# Altium schematic sheet [04] - CPU - DDR3, DDR3 MEM.SchDoc
size A2; DocumentNumber: 4; SheetNumber: 4; SheetTotal: 20
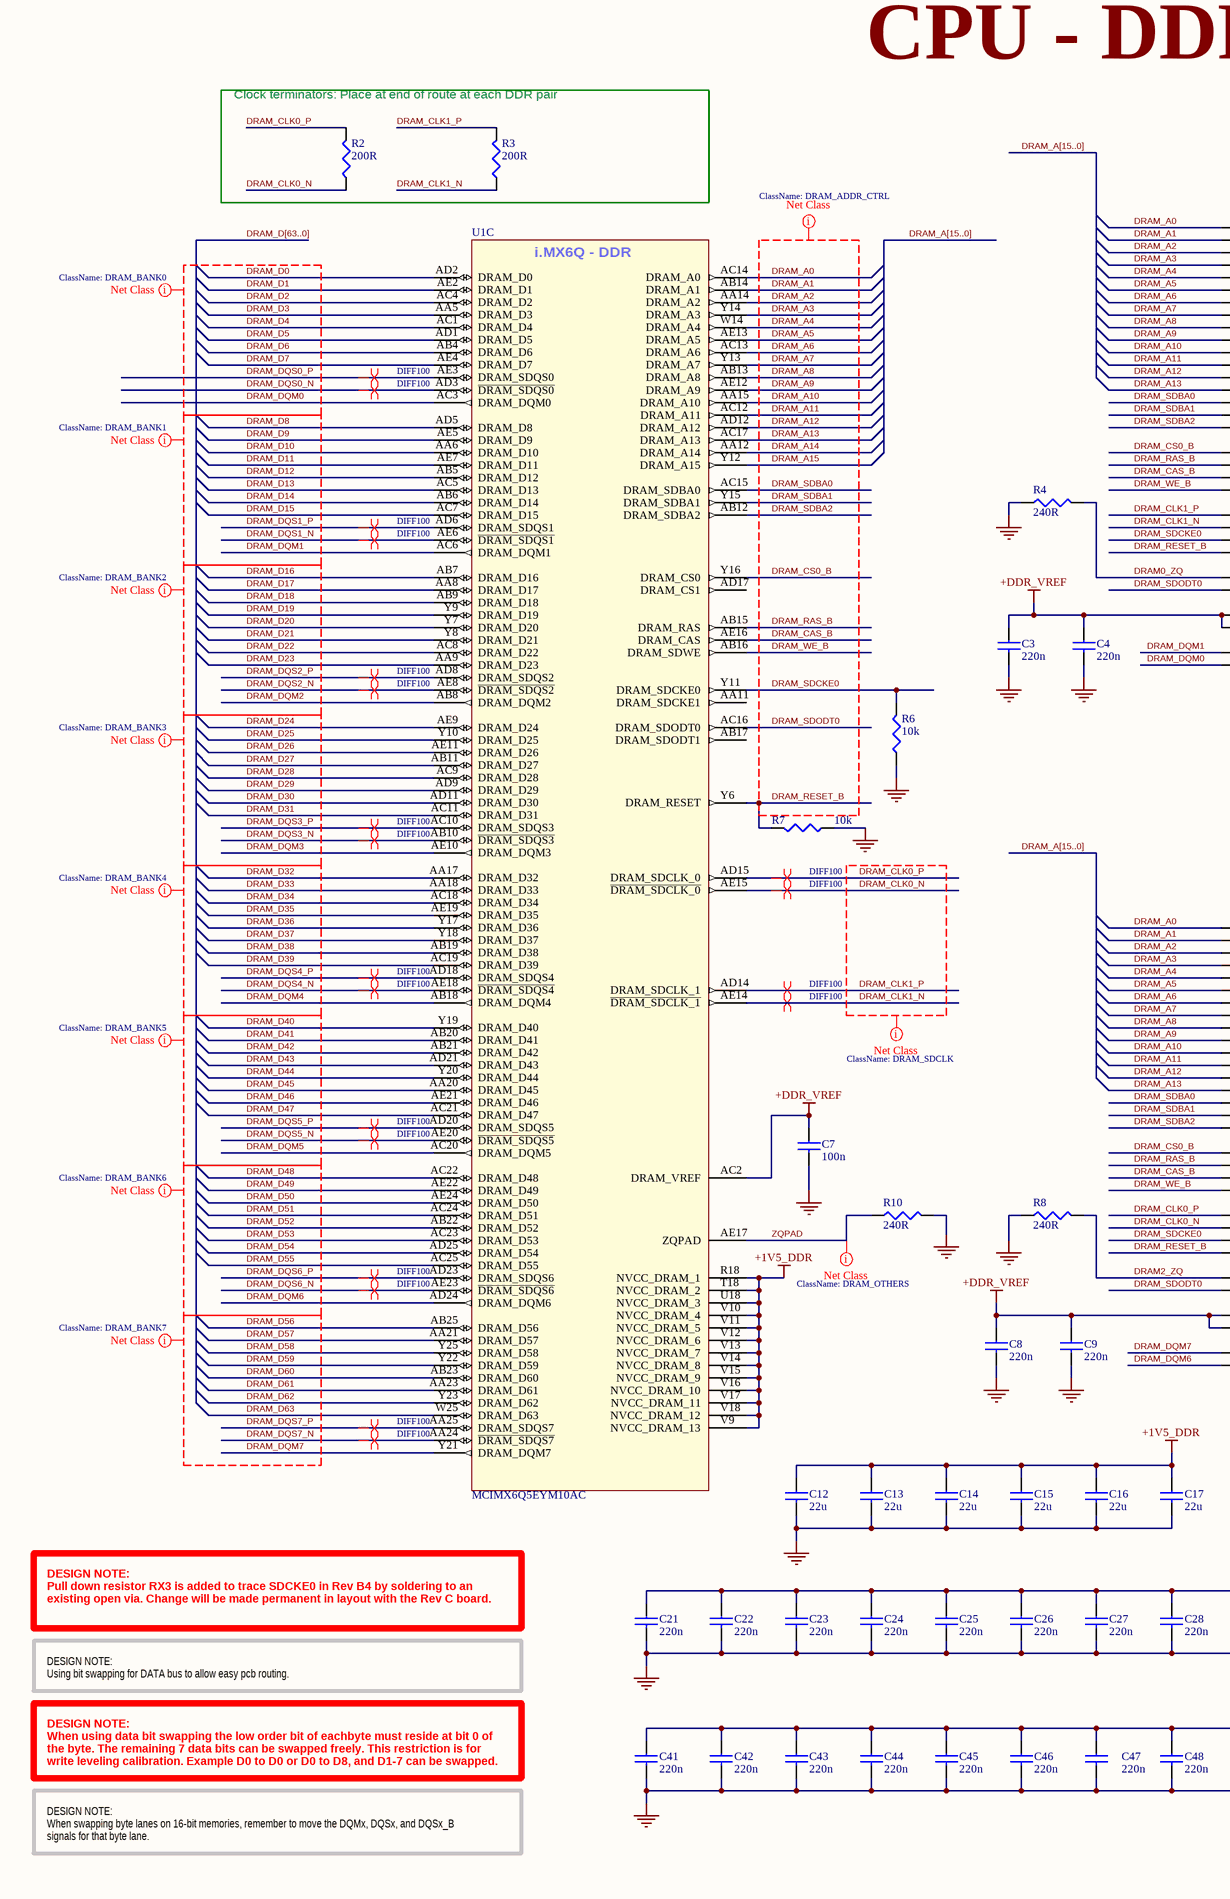
[diagram p0: [04] - CPU - DDR3, DDR3 MEM.SchDoc, left]
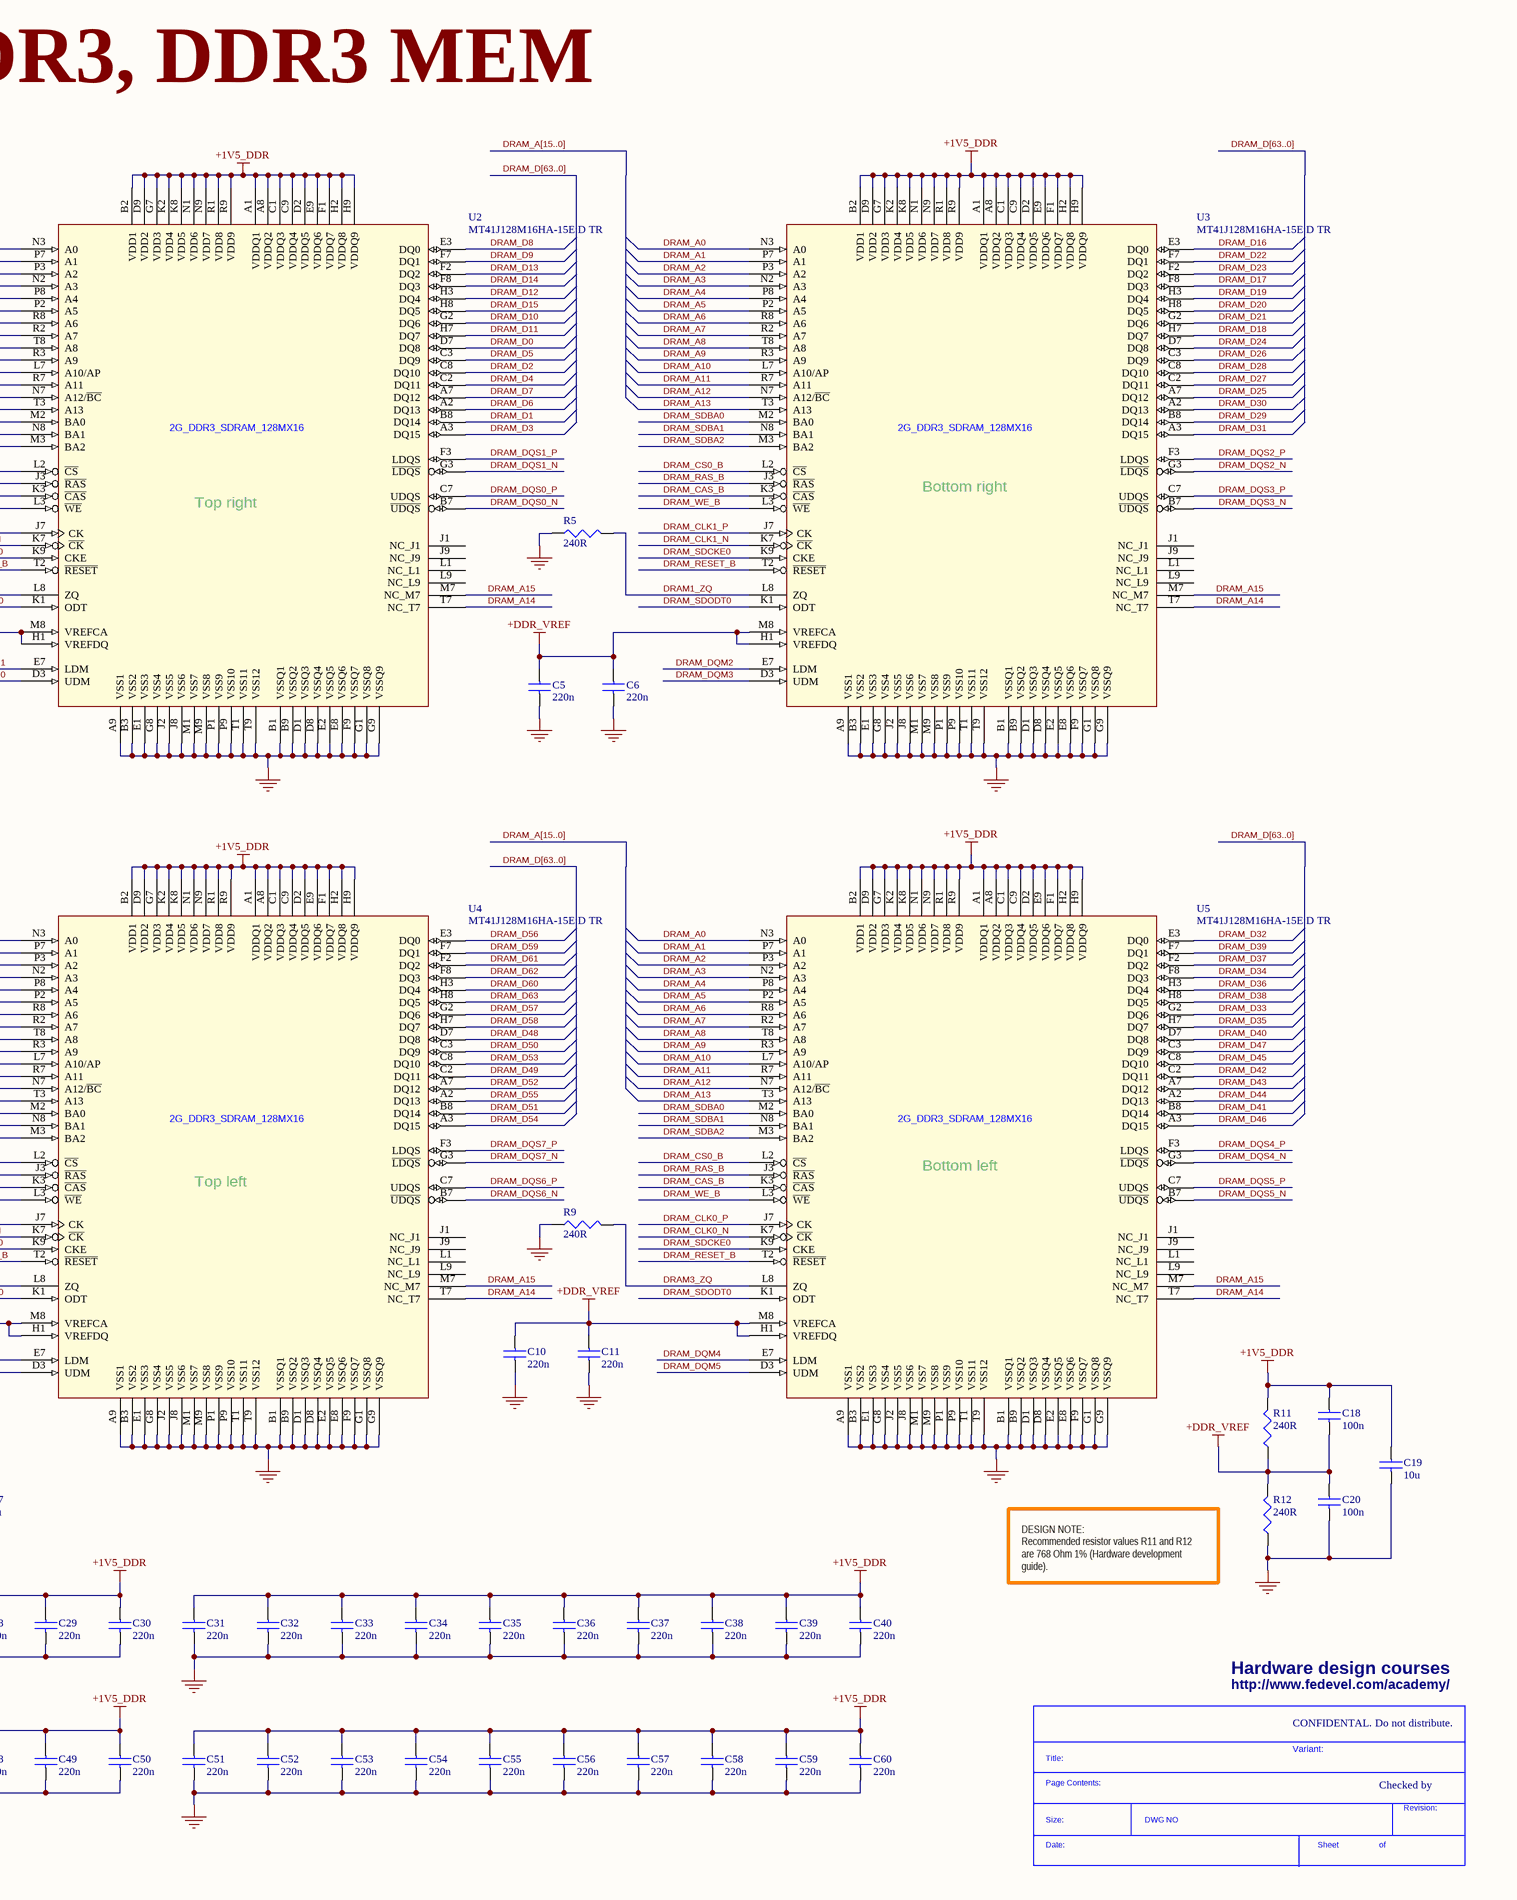
[diagram p1: [04] - CPU - DDR3, DDR3 MEM.SchDoc, right]

## Parts
*  SDTitleBlock  (value not drawn)  (graphical)
C3  220n  [C0402]
C4  220n  [C0402]
C5  220n  [C0402]
C6  220n  [C0402]
C7  100n  [C0402]
C8  220n  [C0402]
C9  220n  [C0402]
C10  220n  [C0402]
C11  220n  [C0402]
C12  22u  [C0603]
C13  22u  [C0603]
C14  22u  [C0603]
C15  22u  [C0603]
C16  22u  [C0603]
C17  22u  [C0603]
C18  100n  [C0402]
C19  10u  [C0603]
C20  100n  [C0402]
C21  220n  [C0402]
C22  220n  [C0402]
C23  220n  [C0402]
C24  220n  [C0402]
C25  220n  [C0402]
C26  220n  [C0402]
C27  220n  [C0402]
C28  220n  [C0402]
C29  220n  [C0402]
C30  220n  [C0402]
C31  220n  [C0402]
C32  220n  [C0402]
C33  220n  [C0402]
C34  220n  [C0402]
C35  220n  [C0402]
C36  220n  [C0402]
C37  220n  [C0402]
C38  220n  [C0402]
C39  220n  [C0402]
C40  220n  [C0402]
C41  220n  [C0402]
C42  220n  [C0402]
C43  220n  [C0402]
C44  220n  [C0402]
C45  220n  [C0402]
C46  220n  [C0402]
C47  220n  [C0402]
C48  220n  [C0402]
C49  220n  [C0402]
C50  220n  [C0402]
C51  220n  [C0402]
C52  220n  [C0402]
C53  220n  [C0402]
C54  220n  [C0402]
C55  220n  [C0402]
C56  220n  [C0402]
C57  220n  [C0402]
C58  220n  [C0402]
C59  220n  [C0402]
C60  220n  [C0402]
R2  200R  [R0402]
R3  200R  [R0402]
R4  240R  [R0402]
R5  240R  [R0402]
R6  10k  [R0402]
R7  10k  [R0402]
R8  240R  [R0402]
R9  240R  [R0402]
R10  240R  [R0402]
R11  240R  [R0402]
R12  240R  [R0402]
U1  MCIMX6Q5EYM10AC  [PBGA624]  (part C of 15)
U2  MT41J128M16HA-15E:D TR  [96_FPGA_DD3]
U3  MT41J128M16HA-15E:D TR  [96_FPGA_DD3]
U4  MT41J128M16HA-15E:D TR  [96_FPGA_DD3]
U5  MT41J128M16HA-15E:D TR  [96_FPGA_DD3]

## Blocks framed on the sheet
Clock terminators: Place at end of route at each DDR pair: R2 R3

## Nets
+1V5_DDR: C12.1 C13.1 C14.1 C15.1 C16.1 C17.1 C18.1 C19.1 C21.1 C22.1 C23.1 C24.1 C25.1 C26.1 C27.1 C28.1 C29.1 C30.1 C31.1 C32.1 C33.1 C34.1 C35.1 C36.1 C37.1 C38.1 C39.1 C40.1 C41.1 C42.1 C43.1 C44.1 C45.1 C46.1 C47.1 C48.1 C49.1 C50.1 C51.1 C52.1 C53.1 C54.1 C55.1 C56.1 C57.1 C58.1 C59.1 C60.1 R11.2 U1.R18(NVCC_DRAM_1) U1.T18(NVCC_DRAM_2) U1.U18(NVCC_DRAM_3) U1.V9(NVCC_DRAM_13) U1.V10(NVCC_DRAM_4) U1.V11(NVCC_DRAM_5) U1.V12(NVCC_DRAM_6) U1.V13(NVCC_DRAM_7) U1.V14(NVCC_DRAM_8) U1.V15(NVCC_DRAM_9) U1.V16(NVCC_DRAM_10) U1.V17(NVCC_DRAM_11) U1.V18(NVCC_DRAM_12) U2.A1(VDDQ1) U2.A8(VDDQ2) U2.B2(VDD1) U2.C1(VDDQ3) U2.C9(VDDQ4) U2.D2(VDDQ5) U2.D9(VDD2) U2.E9(VDDQ6) U2.F1(VDDQ7) U2.G7(VDD3) U2.H2(VDDQ8) U2.H9(VDDQ9) U2.K2(VDD4) U2.K8(VDD5) U2.N1(VDD6) U2.N9(VDD7) U2.R1(VDD8) U2.R9(VDD9) U3.A1(VDDQ1) U3.A8(VDDQ2) U3.B2(VDD1) U3.C1(VDDQ3) U3.C9(VDDQ4) U3.D2(VDDQ5) U3.D9(VDD2) U3.E9(VDDQ6) U3.F1(VDDQ7) U3.G7(VDD3) U3.H2(VDDQ8) U3.H9(VDDQ9) U3.K2(VDD4) U3.K8(VDD5) U3.N1(VDD6) U3.N9(VDD7) U3.R1(VDD8) U3.R9(VDD9) U4.A1(VDDQ1) U4.A8(VDDQ2) U4.B2(VDD1) U4.C1(VDDQ3) U4.C9(VDDQ4) U4.D2(VDDQ5) U4.D9(VDD2) U4.E9(VDDQ6) U4.F1(VDDQ7) U4.G7(VDD3) U4.H2(VDDQ8) U4.H9(VDDQ9) U4.K2(VDD4) U4.K8(VDD5) U4.N1(VDD6) U4.N9(VDD7) U4.R1(VDD8) U4.R9(VDD9) U5.A1(VDDQ1) U5.A8(VDDQ2) U5.B2(VDD1) U5.C1(VDDQ3) U5.C9(VDDQ4) U5.D2(VDDQ5) U5.D9(VDD2) U5.E9(VDDQ6) U5.F1(VDDQ7) U5.G7(VDD3) U5.H2(VDDQ8) U5.H9(VDDQ9) U5.K2(VDD4) U5.K8(VDD5) U5.N1(VDD6) U5.N9(VDD7) U5.R1(VDD8) U5.R9(VDD9)
+DDR_VREF: C3.1 C4.1 C5.1 C6.1 C7.1 C8.1 C9.1 C10.1 C11.1 C18.2 C20.1 R11.1 R12.2 U1.AC2(DRAM_VREF) U2.H1(VREFDQ) U2.M8(VREFCA) U3.H1(VREFDQ) U3.M8(VREFCA) U4.H1(VREFDQ) U4.M8(VREFCA) U5.H1(VREFDQ) U5.M8(VREFCA)
GND: C3.2 C4.2 C5.2 C6.2 C7.2 C8.2 C9.2 C10.2 C11.2 C12.2 C13.2 C14.2 C15.2 C16.2 C17.2 C19.2 C20.2 C21.2 C22.2 C23.2 C24.2 C25.2 C26.2 C27.2 C28.2 C29.2 C30.2 C31.2 C32.2 C33.2 C34.2 C35.2 C36.2 C37.2 C38.2 C39.2 C40.2 C41.2 C42.2 C43.2 C44.2 C45.2 C46.2 C47.2 C48.2 C49.2 C50.2 C51.2 C52.2 C53.2 C54.2 C55.2 C56.2 C57.2 C58.2 C59.2 C60.2 R4.1 R5.1 R6.1 R7.1 R8.1 R9.1 R10.2 R12.1 U2.A9(VSS1) U2.B1(VSSQ1) U2.B3(VSS2) U2.B9(VSSQ2) U2.D1(VSSQ3) U2.D8(VSSQ4) U2.E1(VSS3) U2.E2(VSSQ5) U2.E8(VSSQ6) U2.F9(VSSQ7) U2.G1(VSSQ8) U2.G8(VSS4) U2.G9(VSSQ9) U2.J2(VSS5) U2.J8(VSS6) U2.M1(VSS7) U2.M9(VSS8) U2.P1(VSS9) U2.P9(VSS10) U2.T1(VSS11) U2.T9(VSS12) U3.A9(VSS1) U3.B1(VSSQ1) U3.B3(VSS2) U3.B9(VSSQ2) U3.D1(VSSQ3) U3.D8(VSSQ4) U3.E1(VSS3) U3.E2(VSSQ5) U3.E8(VSSQ6) U3.F9(VSSQ7) U3.G1(VSSQ8) U3.G8(VSS4) U3.G9(VSSQ9) U3.J2(VSS5) U3.J8(VSS6) U3.M1(VSS7) U3.M9(VSS8) U3.P1(VSS9) U3.P9(VSS10) U3.T1(VSS11) U3.T9(VSS12) U4.A9(VSS1) U4.B1(VSSQ1) U4.B3(VSS2) U4.B9(VSSQ2) U4.D1(VSSQ3) U4.D8(VSSQ4) U4.E1(VSS3) U4.E2(VSSQ5) U4.E8(VSSQ6) U4.F9(VSSQ7) U4.G1(VSSQ8) U4.G8(VSS4) U4.G9(VSSQ9) U4.J2(VSS5) U4.J8(VSS6) U4.M1(VSS7) U4.M9(VSS8) U4.P1(VSS9) U4.P9(VSS10) U4.T1(VSS11) U4.T9(VSS12) U5.A9(VSS1) U5.B1(VSSQ1) U5.B3(VSS2) U5.B9(VSSQ2) U5.D1(VSSQ3) U5.D8(VSSQ4) U5.E1(VSS3) U5.E2(VSSQ5) U5.E8(VSSQ6) U5.F9(VSSQ7) U5.G1(VSSQ8) U5.G8(VSS4) U5.G9(VSSQ9) U5.J2(VSS5) U5.J8(VSS6) U5.M1(VSS7) U5.M9(VSS8) U5.P1(VSS9) U5.P9(VSS10) U5.T1(VSS11) U5.T9(VSS12)
DRAM0_ZQ: R4.2 U2.L8(ZQ)
DRAM1_ZQ: R5.2 U3.L8(ZQ)
DRAM2_ZQ: R8.2 U4.L8(ZQ)
DRAM3_ZQ: R9.2 U5.L8(ZQ)
DRAM_A0: U1.AC14(DRAM_A0) U2.N3(A0) U3.N3(A0) U4.N3(A0) U5.N3(A0)
DRAM_A1: U1.AB14(DRAM_A1) U2.P7(A1) U3.P7(A1) U4.P7(A1) U5.P7(A1)
DRAM_A2: U1.AA14(DRAM_A2) U2.P3(A2) U3.P3(A2) U4.P3(A2) U5.P3(A2)
DRAM_A3: U1.Y14(DRAM_A3) U2.N2(A3) U3.N2(A3) U4.N2(A3) U5.N2(A3)
DRAM_A4: U1.W14(DRAM_A4) U2.P8(A4) U3.P8(A4) U4.P8(A4) U5.P8(A4)
DRAM_A5: U1.AE13(DRAM_A5) U2.P2(A5) U3.P2(A5) U4.P2(A5) U5.P2(A5)
DRAM_A6: U1.AC13(DRAM_A6) U2.R8(A6) U3.R8(A6) U4.R8(A6) U5.R8(A6)
DRAM_A7: U1.Y13(DRAM_A7) U2.R2(A7) U3.R2(A7) U4.R2(A7) U5.R2(A7)
DRAM_A8: U1.AB13(DRAM_A8) U2.T8(A8) U3.T8(A8) U4.T8(A8) U5.T8(A8)
DRAM_A9: U1.AE12(DRAM_A9) U2.R3(A9) U3.R3(A9) U4.R3(A9) U5.R3(A9)
DRAM_A10: U1.AA15(DRAM_A10) U2.L7(A10/AP) U3.L7(A10/AP) U4.L7(A10/AP) U5.L7(A10/AP)
DRAM_A11: U1.AC12(DRAM_A11) U2.R7(A11) U3.R7(A11) U4.R7(A11) U5.R7(A11)
DRAM_A12: U1.AD12(DRAM_A12) U2.N7(A12/~{BC}) U3.N7(A12/~{BC}) U4.N7(A12/~{BC}) U5.N7(A12/~{BC})
DRAM_A13: U1.AC17(DRAM_A13) U2.T3(A13) U3.T3(A13) U4.T3(A13) U5.T3(A13)
DRAM_A14: U1.AA12(DRAM_A14) U2.T7(NC_T7) U3.T7(NC_T7) U4.T7(NC_T7) U5.T7(NC_T7)
DRAM_A15: U1.Y12(DRAM_A15) U2.M7(NC_M7) U3.M7(NC_M7) U4.M7(NC_M7) U5.M7(NC_M7)
DRAM_CAS_B: U1.AE16(DRAM_CAS) U2.K3(~{CAS}) U3.K3(~{CAS}) U4.K3(~{CAS}) U5.K3(~{CAS})
DRAM_CLK0_N: R2.1 U1.AE15(~{DRAM_SDCLK_0}) U4.K7(~{CK}) U5.K7(~{CK})
DRAM_CLK0_P: R2.2 U1.AD15(DRAM_SDCLK_0) U4.J7(CK) U5.J7(CK)
DRAM_CLK1_N: R3.1 U1.AE14(~{DRAM_SDCLK_1}) U2.K7(~{CK}) U3.K7(~{CK})
DRAM_CLK1_P: R3.2 U1.AD14(DRAM_SDCLK_1) U2.J7(CK) U3.J7(CK)
DRAM_CS0_B: U1.Y16(DRAM_CS0) U2.L2(~{CS}) U3.L2(~{CS}) U4.L2(~{CS}) U5.L2(~{CS})
DRAM_D0: U1.AD2(DRAM_D0) U2.D7(DQ8)
DRAM_D1: U1.AE2(DRAM_D1) U2.B8(DQ14)
DRAM_D2: U1.AC4(DRAM_D2) U2.C8(DQ10)
DRAM_D3: U1.AA5(DRAM_D3) U2.A3(DQ15)
DRAM_D4: U1.AC1(DRAM_D4) U2.C2(DQ11)
DRAM_D5: U1.AD1(DRAM_D5) U2.C3(DQ9)
DRAM_D6: U1.AB4(DRAM_D6) U2.A2(DQ13)
DRAM_D7: U1.AE4(DRAM_D7) U2.A7(DQ12)
DRAM_D8: U1.AD5(DRAM_D8) U2.E3(DQ0)
DRAM_D9: U1.AE5(DRAM_D9) U2.F7(DQ1)
DRAM_D10: U1.AA6(DRAM_D10) U2.G2(DQ6)
DRAM_D11: U1.AE7(DRAM_D11) U2.H7(DQ7)
DRAM_D12: U1.AB5(DRAM_D12) U2.H3(DQ4)
DRAM_D13: U1.AC5(DRAM_D13) U2.F2(DQ2)
DRAM_D14: U1.AB6(DRAM_D14) U2.F8(DQ3)
DRAM_D15: U1.AC7(DRAM_D15) U2.H8(DQ5)
DRAM_D16: U1.AB7(DRAM_D16) U3.E3(DQ0)
DRAM_D17: U1.AA8(DRAM_D17) U3.F8(DQ3)
DRAM_D18: U1.AB9(DRAM_D18) U3.H7(DQ7)
DRAM_D19: U1.Y9(DRAM_D19) U3.H3(DQ4)
DRAM_D20: U1.Y7(DRAM_D20) U3.H8(DQ5)
DRAM_D21: U1.Y8(DRAM_D21) U3.G2(DQ6)
DRAM_D22: U1.AC8(DRAM_D22) U3.F7(DQ1)
DRAM_D23: U1.AA9(DRAM_D23) U3.F2(DQ2)
DRAM_D24: U1.AE9(DRAM_D24) U3.D7(DQ8)
DRAM_D25: U1.Y10(DRAM_D25) U3.A7(DQ12)
DRAM_D26: U1.AE11(DRAM_D26) U3.C3(DQ9)
DRAM_D27: U1.AB11(DRAM_D27) U3.C2(DQ11)
DRAM_D28: U1.AC9(DRAM_D28) U3.C8(DQ10)
DRAM_D29: U1.AD9(DRAM_D29) U3.B8(DQ14)
DRAM_D30: U1.AD11(DRAM_D30) U3.A2(DQ13)
DRAM_D31: U1.AC11(DRAM_D31) U3.A3(DQ15)
DRAM_D32: U1.AA17(DRAM_D32) U5.E3(DQ0)
DRAM_D33: U1.AA18(DRAM_D33) U5.G2(DQ6)
DRAM_D34: U1.AC18(DRAM_D34) U5.F8(DQ3)
DRAM_D35: U1.AE19(DRAM_D35) U5.H7(DQ7)
DRAM_D36: U1.Y17(DRAM_D36) U5.H3(DQ4)
DRAM_D37: U1.Y18(DRAM_D37) U5.F2(DQ2)
DRAM_D38: U1.AB19(DRAM_D38) U5.H8(DQ5)
DRAM_D39: U1.AC19(DRAM_D39) U5.F7(DQ1)
DRAM_D40: U1.Y19(DRAM_D40) U5.D7(DQ8)
DRAM_D41: U1.AB20(DRAM_D41) U5.B8(DQ14)
DRAM_D42: U1.AB21(DRAM_D42) U5.C2(DQ11)
DRAM_D43: U1.AD21(DRAM_D43) U5.A7(DQ12)
DRAM_D44: U1.Y20(DRAM_D44) U5.A2(DQ13)
DRAM_D45: U1.AA20(DRAM_D45) U5.C8(DQ10)
DRAM_D46: U1.AE21(DRAM_D46) U5.A3(DQ15)
DRAM_D47: U1.AC21(DRAM_D47) U5.C3(DQ9)
DRAM_D48: U1.AC22(DRAM_D48) U4.D7(DQ8)
DRAM_D49: U1.AE22(DRAM_D49) U4.C2(DQ11)
DRAM_D50: U1.AE24(DRAM_D50) U4.C3(DQ9)
DRAM_D51: U1.AC24(DRAM_D51) U4.B8(DQ14)
DRAM_D52: U1.AB22(DRAM_D52) U4.A7(DQ12)
DRAM_D53: U1.AC23(DRAM_D53) U4.C8(DQ10)
DRAM_D54: U1.AD25(DRAM_D54) U4.A3(DQ15)
DRAM_D55: U1.AC25(DRAM_D55) U4.A2(DQ13)
DRAM_D56: U1.AB25(DRAM_D56) U4.E3(DQ0)
DRAM_D57: U1.AA21(DRAM_D57) U4.G2(DQ6)
DRAM_D58: U1.Y25(DRAM_D58) U4.H7(DQ7)
DRAM_D59: U1.Y22(DRAM_D59) U4.F7(DQ1)
DRAM_D60: U1.AB23(DRAM_D60) U4.H3(DQ4)
DRAM_D61: U1.AA23(DRAM_D61) U4.F2(DQ2)
DRAM_D62: U1.Y23(DRAM_D62) U4.F8(DQ3)
DRAM_D63: U1.W25(DRAM_D63) U4.H8(DQ5)
DRAM_DQM0: U1.AC3(DRAM_DQM0) U2.D3(UDM)
DRAM_DQM1: U1.AC6(DRAM_DQM1) U2.E7(LDM)
DRAM_DQM2: U1.AB8(DRAM_DQM2) U3.E7(LDM)
DRAM_DQM3: U1.AE10(DRAM_DQM3) U3.D3(UDM)
DRAM_DQM4: U1.AB18(DRAM_DQM4) U5.E7(LDM)
DRAM_DQM5: U1.AC20(DRAM_DQM5) U5.D3(UDM)
DRAM_DQM6: U1.AD24(DRAM_DQM6) U4.D3(UDM)
DRAM_DQM7: U1.Y21(DRAM_DQM7) U4.E7(LDM)
DRAM_DQS0_N: U1.AD3(~{DRAM_SDQS0}) U2.B7(~{UDQS})
DRAM_DQS0_P: U1.AE3(DRAM_SDQS0) U2.C7(UDQS)
DRAM_DQS1_N: U1.AE6(~{DRAM_SDQS1}) U2.G3(~{LDQS})
DRAM_DQS1_P: U1.AD6(DRAM_SDQS1) U2.F3(LDQS)
DRAM_DQS2_N: U1.AE8(~{DRAM_SDQS2}) U3.G3(~{LDQS})
DRAM_DQS2_P: U1.AD8(DRAM_SDQS2) U3.F3(LDQS)
DRAM_DQS3_N: U1.AB10(~{DRAM_SDQS3}) U3.B7(~{UDQS})
DRAM_DQS3_P: U1.AC10(DRAM_SDQS3) U3.C7(UDQS)
DRAM_DQS4_N: U1.AE18(~{DRAM_SDQS4}) U5.G3(~{LDQS})
DRAM_DQS4_P: U1.AD18(DRAM_SDQS4) U5.F3(LDQS)
DRAM_DQS5_N: U1.AE20(~{DRAM_SDQS5}) U5.B7(~{UDQS})
DRAM_DQS5_P: U1.AD20(DRAM_SDQS5) U5.C7(UDQS)
DRAM_DQS6_N: U1.AE23(~{DRAM_SDQS6}) U4.B7(~{UDQS})
DRAM_DQS6_P: U1.AD23(DRAM_SDQS6) U4.C7(UDQS)
DRAM_DQS7_N: U1.AA24(~{DRAM_SDQS7}) U4.G3(~{LDQS})
DRAM_DQS7_P: U1.AA25(DRAM_SDQS7) U4.F3(LDQS)
DRAM_RAS_B: U1.AB15(DRAM_RAS) U2.J3(~{RAS}) U3.J3(~{RAS}) U4.J3(~{RAS}) U5.J3(~{RAS})
DRAM_RESET_B: R7.2 U1.Y6(DRAM_RESET) U2.T2(~{RESET}) U3.T2(~{RESET}) U4.T2(~{RESET}) U5.T2(~{RESET})
DRAM_SDBA0: U1.AC15(DRAM_SDBA0) U2.M2(BA0) U3.M2(BA0) U4.M2(BA0) U5.M2(BA0)
DRAM_SDBA1: U1.Y15(DRAM_SDBA1) U2.N8(BA1) U3.N8(BA1) U4.N8(BA1) U5.N8(BA1)
DRAM_SDBA2: U1.AB12(DRAM_SDBA2) U2.M3(BA2) U3.M3(BA2) U4.M3(BA2) U5.M3(BA2)
DRAM_SDCKE0: R6.2 U1.Y11(DRAM_SDCKE0) U2.K9(CKE) U3.K9(CKE) U4.K9(CKE) U5.K9(CKE)
DRAM_SDODT0: U1.AC16(DRAM_SDODT0) U2.K1(ODT) U3.K1(ODT) U4.K1(ODT) U5.K1(ODT)
DRAM_WE_B: U1.AB16(DRAM_SDWE) U2.L3(~{WE}) U3.L3(~{WE}) U4.L3(~{WE}) U5.L3(~{WE})
ZQPAD: R10.1 U1.AE17(ZQPAD)

Not connected (* = marked no-connect by the designer): U1 AA11(DRAM_SDCKE1) AB17(DRAM_SDODT1) AD17(DRAM_CS1); U2 J1(NC_J1) J9(NC_J9) L1(NC_L1) L9(NC_L9); U3 J1(NC_J1) J9(NC_J9) L1(NC_L1) L9(NC_L9); U4 J1(NC_J1) J9(NC_J9) L1(NC_L1) L9(NC_L9); U5 J1(NC_J1) J9(NC_J9) L1(NC_L1) L9(NC_L9)

## Buses and harness runs
bus DRAM_A[15..0]
bus DRAM_D[63..0]

## Layout directives
net class DRAM_BANK0: DRAM_D0, DRAM_D1, DRAM_D2, DRAM_D3, DRAM_D4, DRAM_D5, DRAM_D6, DRAM_D7, DRAM_DQM0, DRAM_DQS0_N, DRAM_DQS0_P
net class DRAM_BANK1: DRAM_D8, DRAM_D9, DRAM_D10, DRAM_D11, DRAM_D12, DRAM_D13, DRAM_D14, DRAM_D15, DRAM_DQM1, DRAM_DQS1_N, DRAM_DQS1_P
net class DRAM_BANK2: DRAM_D16, DRAM_D17, DRAM_D18, DRAM_D19, DRAM_D20, DRAM_D21, DRAM_D22, DRAM_D23, DRAM_DQM2, DRAM_DQS2_N, DRAM_DQS2_P
net class DRAM_BANK3: DRAM_D24, DRAM_D25, DRAM_D26, DRAM_D27, DRAM_D28, DRAM_D29, DRAM_D30, DRAM_D31, DRAM_DQM3, DRAM_DQS3_N, DRAM_DQS3_P
net class DRAM_BANK4: DRAM_D32, DRAM_D33, DRAM_D34, DRAM_D35, DRAM_D36, DRAM_D37, DRAM_D38, DRAM_D39, DRAM_DQM4, DRAM_DQS4_N, DRAM_DQS4_P
net class DRAM_BANK5: DRAM_D40, DRAM_D41, DRAM_D42, DRAM_D43, DRAM_D44, DRAM_D45, DRAM_D46, DRAM_D47, DRAM_DQM5, DRAM_DQS5_N, DRAM_DQS5_P
net class DRAM_BANK6: DRAM_D48, DRAM_D49, DRAM_D50, DRAM_D51, DRAM_D52, DRAM_D53, DRAM_D54, DRAM_D55, DRAM_DQM6, DRAM_DQS6_N, DRAM_DQS6_P
net class DRAM_BANK7: DRAM_D56, DRAM_D57, DRAM_D58, DRAM_D59, DRAM_D60, DRAM_D61, DRAM_D62, DRAM_D63, DRAM_DQM7, DRAM_DQS7_N, DRAM_DQS7_P
differential pair; net class DIFF100: DRAM_CLK0_N, DRAM_CLK0_P, DRAM_CLK1_N, DRAM_CLK1_P, DRAM_DQS0_N, DRAM_DQS0_P, DRAM_DQS1_N, DRAM_DQS1_P, DRAM_DQS2_N, DRAM_DQS2_P, DRAM_DQS3_N, DRAM_DQS3_P, DRAM_DQS4_N, DRAM_DQS4_P, DRAM_DQS5_N, DRAM_DQS5_P, DRAM_DQS6_N, DRAM_DQS6_P, DRAM_DQS7_N, DRAM_DQS7_P
net class DRAM_ADDR_CTRL: DRAM_A0, DRAM_A1, DRAM_A2, DRAM_A3, DRAM_A4, DRAM_A5, DRAM_A6, DRAM_A7, DRAM_A8, DRAM_A9, DRAM_A10, DRAM_A11, DRAM_A12, DRAM_A13, DRAM_A14, DRAM_A15, DRAM_CAS_B, DRAM_CS0_B, DRAM_RAS_B, DRAM_RESET_B, DRAM_SDBA0, DRAM_SDBA1, DRAM_SDBA2, DRAM_SDCKE0, DRAM_SDODT0, DRAM_WE_B
net class DRAM_SDCLK: DRAM_CLK0_N, DRAM_CLK0_P, DRAM_CLK1_N, DRAM_CLK1_P
net class DRAM_OTHERS: ZQPAD

## Notes on the sheet
- CPU - DDR3, DDR3 MEM
- (near U2) Top right
- (near U3) Bottom right
- (near U4) Top left
- (near U5) Bottom left
- DESIGN NOTE:
  Pull down resistor RX3 is added to trace SDCKE0 in Rev B4 by soldering to an existing open via. Change will be made permanent in layout with the Rev C board.
- DESIGN NOTE:
  Recommended resistor values R11 and R12 are 768 Ohm 1% (Hardware development guide).
- Hardware design courses
- DESIGN NOTE:
  Using bit swapping for DATA bus to allow easy pcb routing.
- http://www.fedevel.com/academy/
- CONFIDENTAL. Do not distribute.
- DESIGN NOTE:
  When using data bit swapping the low order bit of eachbyte must reside at bit 0 of the byte. The remaining 7 data bits can be swapped freely. This restriction is for write leveling calibration. Example D0 to D0 or D0 to D8, and D1-7 can be swapped.
- Variant:
- Checked by
- DESIGN NOTE:
  When swapping byte lanes on 16-bit memories, remember to move the DQMx, DQSx, and DQSx_B signals for that byte lane.
- (in symbol MCIMX6Q5EYM10AC, part C) i.MX6Q - DDR
- (in symbol MT41J128M16HA-15E:D TR) 2G_DDR3_SDRAM_128MX16
- (in symbol SDTitleBlock) Title:; Page Contents:; Revision:; Size:; DWG NO; Date:; Sheet; of

## Library data of the parts
C3-C6 C8-C11 C21-C60 = C1005X5R1E224M: CAP CER .22UF 25V X5R 20% 0402; Manufacturer: TDK Corporation; Capacitance: 0.22µF; Value: 220nF; .Checked PCB: used; Description: CAP CER 0.22UF 25V 20% X5R 0402; Category: Capacitors; Supplier Part Number: 445-5945-1-ND; Manufacturer Part Number: C1005X5R1E224M; Operating Temperature: -55°C ~ 85°C; Package / Case: 0402 (1005 Metric); Price 1k [$]: 0.02600; .Checked SCH: used; Voltage - Rated: 25V; Supplier: Digikey; Supplier 1: Digi-Key; Supplier Part Number 1: 445-5945-1-ND; RoHS: RoHS Compliant; Stock 1: 54593; Pricing 1: 1=0.3, 10=0.2, 100=0.08, 250=0.05752, 500=0.041, 1000=0.03 (USD); Tolerance: ±20%; Temperature Coefficient: X5R; Mounting Type: Surface Mount, MLCC; Applications: General Purpose; Ratings: -; Size / Dimension: 0.039" L x 0.020" W (1.00mm x 0.50mm); Height - Seated (Max): -; Thickness (Max): 0.022" (0.55mm); Lead Spacing: -; Features: -; Packaging: Cut Tape (CT); Lead Style: -; ComponentLink1URL: http://www.tdk.co.jp/tefe02/e412_c.pdf; ComponentLink1Description: http://www.tdk.co.jp/tefe02/e412_c.pdf
C7 C18 C20 = C1005X5R1H104K: CAP CER .10UF 50V X5R 10% 0402; Manufacturer: TDK Corporation; Capacitance: 0.1µF; Value: 100nF; .Checked PCB: used; Description: CAP CER 0.1UF 50V 10% X5R 0402; Category: Capacitors; Supplier Part Number: 445-5942-1-ND; Manufacturer Part Number: C1005X5R1H104K; Operating Temperature: -55°C ~ 85°C; Package / Case: 0402 (1005 Metric); Price 1k [$]: 0.02340; .Checked SCH: used; Voltage - Rated: 50V; Supplier: Digikey; Supplier 1: Digi-Key; Supplier Part Number 1: 445-5942-1-ND; RoHS: RoHS Compliant; Stock 1: 106926; Pricing 1: 1=0.27, 10=0.18, 100=0.072, 250=0.05176, 500=0.0369, 1000=0.027 (USD); Tolerance: ±10%; Temperature Coefficient: X5R; Mounting Type: Surface Mount, MLCC; Applications: General Purpose; Ratings: -; Size / Dimension: 0.039" L x 0.020" W (1.00mm x 0.50mm); Height - Seated (Max): -; Thickness (Max): 0.022" (0.55mm); Lead Spacing: -; Features: -; Packaging: Cut Tape (CT); Lead Style: -; ComponentLink1URL: http://www.tdk.co.jp/tefe02/e412_c.pdf; ComponentLink1Description: http://www.tdk.co.jp/tefe02/e412_c.pdf
C12-C17 = GRM188R60G226MEA0L: CAP CER 22UF 4V 20% X5R 0603; Manufacturer: Murata Electronics North America; Capacitance: 22µF; .Checked PCB: RF, used by MM; .Checked SCH: MM, checked by RF; .Creator: MM; Supplier 1: Digi-Key; Supplier Part Number 1: 490-5526-1-ND; Manufacturer Part Number: GRM188R60G226MEA0L; RoHS: RoHS Compliant; Category: Capacitors; Stock 1: 5760; Pricing 1: 1=0.79, 10=0.663, 50=0.4752, 100=0.4158, 250=0.32672, 500=0.297, 1000=0.2376 (USD); Voltage - Rated: 4V; Tolerance: ±20%; Temperature Coefficient: X5R; Mounting Type: Surface Mount, MLCC; Operating Temperature: -55°C ~ 85°C; Applications: General Purpose; Ratings: -; Package / Case: 0603 (1608 Metric); Size / Dimension: 0.063" L x 0.031" W (1.60mm x 0.80mm); Height - Seated (Max): -; Thickness (Max): 0.035" (0.90mm); Lead Spacing: -; Features: -; Packaging: Cut Tape (CT); Lead Style: -; ComponentLink1URL: http://www.murata.com/products/catalog/pdf/c02e.pdf; ComponentLink1Description: http://www.murata.com/products/catalog/pdf/c02e.pdf
C19 = C1608X5R0J106M: CAP CER 10UF 6.3V X5R 20% 0603; Manufacturer: TDK Corporation; Capacitance: 10µF; Value: 10µF; .Checked PCB: used; Description: CAP CER 10UF 6.3V 20% X5R 0603; Category: Capacitors; Supplier Part Number: 445-4112-1-ND; Manufacturer Part Number: C1608X5R0J106M; Operating Temperature: -55°C ~ 85°C; Package / Case: 0603 (1608 Metric); Price 1k [$]: 0.08580; .Checked SCH: used; Voltage - Rated: 6.3V; Features: Low ESR; Supplier: Digikey; Supplier 1: Digi-Key; Supplier Part Number 1: 445-4112-1-ND; RoHS: RoHS Compliant; Stock 1: 48157; Pricing 1: 1=0.46, 10=0.363, 100=0.1898, 250=0.14024, 500=0.1089, 1000=0.0858 (USD); Tolerance: ±20%; Temperature Coefficient: X5R; Mounting Type: Surface Mount, MLCC; Applications: General Purpose; Ratings: -; Size / Dimension: 0.063" L x 0.031" W (1.60mm x 0.80mm); Height - Seated (Max): -; Thickness (Max): 0.037" (0.95mm); Lead Spacing: -; Packaging: Cut Tape (CT); Lead Style: -; ComponentLink1URL: http://www.tdk.com/pdf/general_B11.pdf; ComponentLink1Description: http://www.tdk.com/pdf/general_B11.pdf
R2 R3 = CRCW0402200RFKED: RES 200 OHM 1/16W 1% 0402 SMD; Manufacturer: Vishay Dale; Resistance (Ohms): 200; Power (Watts): 0.063W, 1/16W; Temperature Coefficient: ±100ppm/°C; .Checked PCB: RF, used by MM; .Checked SCH: MM, checked by RF; .Creator: MM; Supplier 1: Digi-Key; Manufacturer Part Number: CRCW0402200RFKED; RoHS: RoHS Compliant; Category: Resistors; Stock 1: 251574; Pricing 1: 10=0.083, 50=0.0444, 200=0.0255, 1000=0.0174 (USD); Composition: Thick Film; Features: Automotive AEC-Q200 Qualified; Tolerance: ±1%; Package / Case: 0402 (1005 Metric); Supplier Device Package: 0402 (1005 Metric); Size / Dimension: 0.039" L x 0.020" W (1.00mm x 0.50mm); Height: 0.016" (0.40mm); Number of Terminations: 2; Packaging: Cut Tape (CT); ComponentLink1URL: http://www.vishay.com/doc?20035; ComponentLink1Description: http://www.vishay.com/doc?20035; Supplier Part Number 1: 541-200LCT-ND
R4 R5 R8-R12 = RMCF0402FT240R: RES TF 240 OHM 1% 0.0625W 0402; Manufacturer: Stackpole Electronics Inc; Resistance (Ohms): 240; Power (Watts): 0.063W, 1/16W; .Checked PCB: used; Temperature Coefficient: ±100ppm/°C; Category: Resistors; Supplier Part Number: RMCF0402FT240RCT-ND; Manufacturer Part Number: RMCF0402FT240R; Package / Case: 0402 (1005 Metric); Price 1k [$]: 0.00384; Tolerance: ±1%; Value: 240R; .Checked SCH: used; Supplier: Digikey; Supplier 1: Digi-Key; Supplier Part Number 1: RMCF0402FT240RCT-ND; RoHS: RoHS Compliant; Stock 1: 39860; Pricing 1: 1=0.04, 10=0.025, 50=0.0138, 100=0.0105, 250=0.0078, 500=0.00576, 1000=0.00384 (USD); Composition: Thick Film; Features: -; Size / Dimension: 0.039" L x 0.020" W (1.00mm x 0.50mm); Height: 0.016" (0.40mm); Number of Terminations: 2; Packaging: Cut Tape (CT); ComponentLink1URL: http://www.seielect.com/Catalog/SEI-RMCF.pdf; ComponentLink1Description: http://www.seielect.com/Catalog/SEI-RMCF.pdf
R6 R7 = RC0402FR-0710KL: RES 10.0K OHM 1/16W 1% 0402 SMD; Manufacturer: Yageo; Power (Watts): 0.063W, 1/16W; .Checked PCB: used; Temperature Coefficient: ±100ppm/°C; Category: Resistors; Supplier Part Number: 311-10.0KLRCT-ND; Manufacturer Part Number: RC0402FR-0710KL; Package / Case: 0402 (1005 Metric); Price 1k [$]: 0.01421; Resistance (Ohms): 10K; Tolerance: ±1%; Value: 10k; .Checked SCH: used; Supplier: Digikey; Supplier 1: Digi-Key; Supplier Part Number 1: 311-10.0KLRCT-ND; RoHS: RoHS Compliant; Stock 1: 2916495; Pricing 1: 10=0.014, 50=0.0104, 100=0.0079, 250=0.00584, 500=0.00432, 1000=0.00288 (USD); Composition: Thick Film; Features: -; Size / Dimension: 0.039" L x 0.020" W (1.00mm x 0.50mm); Height: 0.016" (0.40mm); Number of Terminations: 2; Packaging: Cut Tape (CT); ComponentLink1URL: http://www.yageo.com/documents/recent/PYu-RC0402_51_RoHS_L_6.pdf; ComponentLink1Description: http://www.yageo.com/documents/recent/PYu-RC0402_51_RoHS_L_6.pdf
U1 = MCIMX6Q5EYM10AC: IC MCU 32BIT ARM QUAD 624FCBGA; Manufacturer: Freescale Semiconductor; Core Processor: ARM® Cortex™-A9; Core Size: 32-Bit Quad-Core; Speed: 1.0GHz; Connectivity: CAN, EBI/EMI, ESAI, Ethernet, GPMI, I2C, MMC/SD, PCI, SATA, SPI, UART, USB, USB OTG; Peripherals: DMA, HDMI, I2S/SSI/AC97, MIPI CSI, MIMI DSI, MIPI HIS, PWM, WDT; Number of I /O: 224; Program Memory Type: External Program Memory; RAM Size: 256K x 8; Voltage - Supply (Vcc/Vdd): 0.925 V ~ 1.5 V; Oscillator Type: Internal; .Creator: MM; .Checked PCB: MM, checked by RF; Supplier 1: Digi-Key; Manufacturer Part Number: MCIMX6Q5EYM10AC; RoHS: RoHS Compliant; Category: Integrated Circuits (ICs); Stock 1: 0; Pricing 1: 1=54.98, 10=51.922, 25=48.868, 100=30.5424 (USD); Program Memory Size: -; EEPROM Size: -; Data Converters: -; Operating Temperature: -20°C ~ 105°C; Package / Case: 624-FBGA, FCBGA; Packaging: Tray; ComponentLink1URL: http://cache.freescale.com/files/32bit/doc/data_sheet/IMX6DQCEC.pdf; ComponentLink1Description: http://cache.freescale.com/files/32bit/doc/data_sheet/IMX6DQCEC.pdf; Supplier Part Number 1: MCIMX6Q5EYM10AC-ND; .Checked SCH: MM
U2-U5 = MT41J128M16HA-15E:D TR: IC DDR3 SDRAM 2GBIT 667MHZ 96BGA; Manufacturer: Micron Technology Inc; Format - Memory: RAM; Memory Size: 2G (128M x 16); Interface: Parallel; Voltage - Supply: 1.425 V ~ 1.575 V; .Creator: MM; .Checked PCB: RF, used by MM; .Checked SCH: MM, checked by RF; Supplier 1: Digi-Key; Manufacturer Part Number: MT41J128M16HA-15E:D TR; RoHS: RoHS Compliant; Category: Integrated Circuits (ICs); Stock 1: 9228; Pricing 1: 1=11.4, 10=10.557, 25=10.3172, 50=10.26, 100=9.0354, 250=8.58332, 500=8.49746 (USD); Memory Type: DDR3 SDRAM; Speed: 667MHz; Operating Temperature: 0°C ~ 95°C; Package / Case: 96-TFBGA; Supplier Device Package: 96-FBGA (9x14); Packaging: Cut Tape (CT); ComponentLink1URL: http://www.micron.com/~/media/Documents/Products/Data%20Sheet/DRAM/2Gb_DDR3_SDRAM.pdf; ComponentLink1Description: http://www.micron.com/~/media/Documents/Products/Data%20Sheet/DRAM/2Gb_DDR3_SDRAM.pdf; Supplier Part Number 1: 557-1493-1-ND